# Altium schematic sheet cpu.SchDoc
size A3
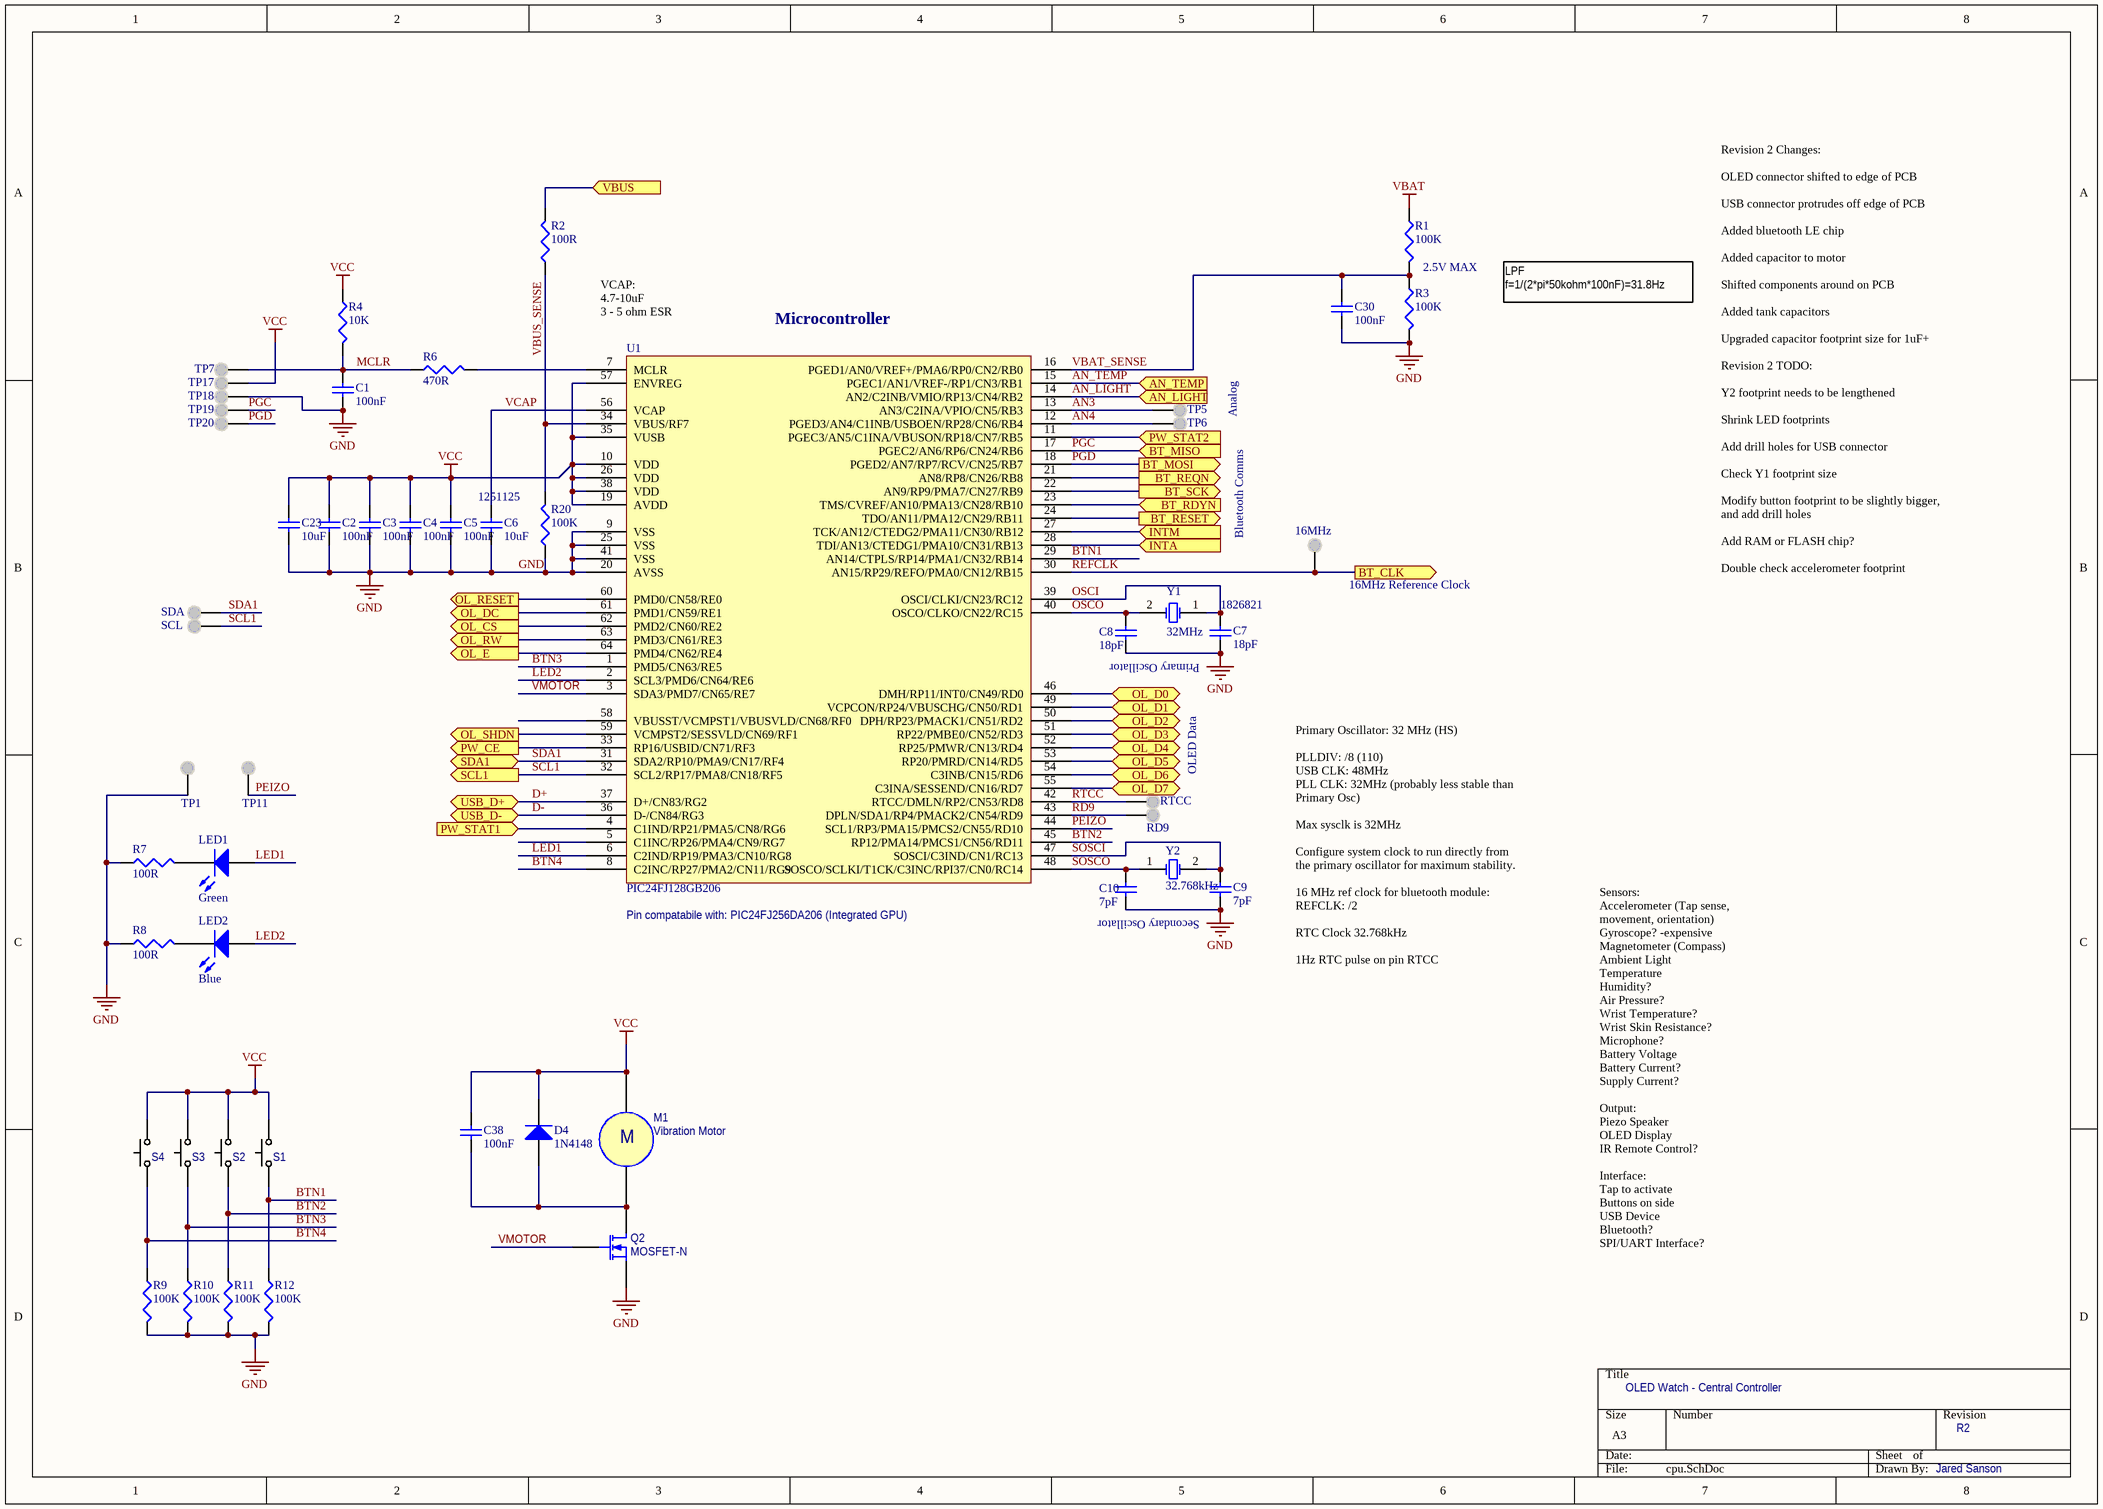
[diagram p0: cpu.SchDoc]

## Parts
C1  value 100nF  [0603C]  (hidden comment: Cap)
C2  value 100nF  [0603C]  (hidden comment: Cap)
C3  value 100nF  [0603C]  (hidden comment: Cap)
C4  value 100nF  [0603C]  (hidden comment: Cap)
C5  value 100nF  [0603C]  (hidden comment: Cap)
C6  value 10uF  Supplier Part Number 1: 1251125  [0805C]  (hidden comment: Cap)
C7  value 18pF  [0603C]  (hidden comment: Cap)
C8  value 18pF  [0603C]  (hidden comment: Cap)
C9  value 7pF  [0603C]  (hidden comment: Cap)
C10  value 7pF  [0603C]  (hidden comment: Cap)
C23  value 10uF  [0805C]  (hidden comment: Cap)
C30  value 100nF  [0603C]  (hidden comment: Cap)
C38  value 100nF  [0603C]  (hidden comment: Cap)
D4  1N4148  [0603D]
LED1  Green  [0603LED]
LED2  Blue  [0603LED]
M1  Vibration Motor  [VIBRATION_MOTOR]
OSC  16MHz  [TESTPOINT_TOP]
Q2  MOSFET-N  [SOT-23B_N]
R1  value 100K  [0603R]  (hidden comment: Res3)
R2  value 100R  [0603R]  (hidden comment: Res3)
R3  value 100K  [0603R]  (hidden comment: Res3)
R4  value 10K  [0603R]  (hidden comment: Res3)
R6  value 470R  [0603R]  (hidden comment: Res3)
R7  value 100R  [0603R]  (hidden comment: Res3)
R8  value 100R  [0603R]  (hidden comment: Res3)
R9  value 100K  [0603R]  (hidden comment: Res3)
R10  value 100K  [0603R]  (hidden comment: Res3)
R11  value 100K  [0603R]  (hidden comment: Res3)
R12  value 100K  [0603R]  (hidden comment: Res3)
R20  value 100K  [0603R]  (hidden comment: Res3)
RD9  (no value)  [TESTPOINT_TOP]
RTCC  RTCC  [TESTPOINT_TOP]  (value not drawn)
S1  SideButton  [SIDE_BUTTON]  (value not drawn)
S2  SideButton  [SIDE_BUTTON]  (value not drawn)
S3  SideButton  [SIDE_BUTTON]  (value not drawn)
S4  SideButton  [SIDE_BUTTON]  (value not drawn)
SCL  SCL  [TESTPOINT_TOP]  (value not drawn)
SDA  SDA  [TESTPOINT_TOP]  (value not drawn)
TP1  PZ-  [TESTPOINT_TOP]  (value not drawn)
TP5  AN4  [TESTPOINT_TOP]  (value not drawn)
TP6  AN5  [TESTPOINT_TOP]  (value not drawn)
TP7  MCLR  [TESTPOINT_TOP]  (value not drawn)
TP11  PZ+  [TESTPOINT_TOP]  (value not drawn)
TP17  VCC  [TESTPOINT_TOP]  (value not drawn)
TP18  GND  [TESTPOINT_TOP]  (value not drawn)
TP19  PGC  [TESTPOINT_TOP]  (value not drawn)
TP20  PGD  [TESTPOINT_TOP]  (value not drawn)
U1  PIC24FJ128GB206  [TQFP_64_10MM]
Y1  32MHz  Supplier Part Number 1: 1826821  [ABRACON32MHZ]
Y2  32.768kHz  [BCY-W2/D1.5]

## Ports
AN_LIGHT (in), AN_TEMP (in), BT_CLK (out), BT_MISO (in), BT_MOSI (out), BT_RDYN (in), BT_REQN (out), BT_RESET (out), BT_SCK (out), INTA (in), INTM (in), OL_CS (out), OL_D0 (bidir), OL_D1 (bidir), OL_D2 (bidir), OL_D3 (bidir), OL_D4 (bidir), OL_D5 (bidir), OL_D6 (bidir), OL_D7 (bidir), OL_DC (out), OL_E (out), OL_RESET (out), OL_RW (out), OL_SHDN (out), PW_CE (out), PW_STAT1 (in), PW_STAT2 (in), SCL1 (out), SDA1 (bidir), USB_D+ (bidir), USB_D- (bidir), VBUS (in)

## Nets
GND: C1.2 C2.2 C3.2 C4.2 C5.2 C6.2 C7.2 C8.2 C9.2 C10.2 C23.2 C30.2 Q2.3(S) R3.2 R7.1 R8.1 R9.2 R10.2 R11.2 R12.2 R20.1 TP1.1(TP) TP18.1(TP) U1.9(VSS) U1.20(AVSS) U1.25(VSS) U1.41(VSS)
VBAT: R1.1
VCC: C2.1 C3.1 C4.1 C5.1 C23.1 C38.1 D4.2(K) M1.1 R4.1 S1.2 S2.2 S3.2 S4.2 TP17.1(TP) U1.10(VDD) U1.19(AVDD) U1.26(VDD) U1.35(VUSB) U1.38(VDD) U1.57(ENVREG)
AN3: TP5.1(TP) U1.13(AN3/C2INA/VPIO/CN5/RB3)
AN4: TP6.1(TP) U1.12(PGED3/AN4/C1INB/USBOEN/RP28/CN6/RB4)
AN_LIGHT: U1.14(AN2/C2INB/VMIO/RP13/CN4/RB2) ; port AN_LIGHT
AN_TEMP: U1.15(PGEC1/AN1/VREF-/RP1/CN3/RB1) ; port AN_TEMP
BT_RDYN: U1.23(TMS/CVREF/AN10/PMA13/CN28/RB10) ; port BT_RDYN
BT_REQN: U1.21(AN8/RP8/CN26/RB8) ; port BT_REQN
BT_RESET: U1.24(TDO/AN11/PMA12/CN29/RB11) ; port BT_RESET
BT_SCK: U1.22(AN9/RP9/PMA7/CN27/RB9) ; port BT_SCK
BTN1: R12.1 S1.1 U1.29(AN14/CTPLS/RP14/PMA1/CN32/RB14)
BTN2: R11.1 S2.1 U1.45(RP12/PMA14/PMCS1/CN56/RD11)
BTN3: R10.1 S3.1 U1.1(PMD5/CN63/RE5)
BTN4: R9.1 S4.1 U1.8(C2INC/RP27/PMA2/CN11/RG9)
D+: U1.37(D+/CN83/RG2) ; port USB_D+
D-: U1.36(D-/CN84/RG3) ; port USB_D-
INTA: U1.28(TDI/AN13/CTEDG1/PMA10/CN31/RB13) ; port INTA
INTM: U1.27(TCK/AN12/CTEDG2/PMA11/CN30/RB12) ; port INTM
LED1: LED1.1(A) U1.6(C2IND/RP19/PMA3/CN10/RG8)
LED2: LED2.1(A) U1.2(SCL3/PMD6/CN64/RE6)
MCLR: C1.1 R4.2 R6.1 TP7.1(TP)
OL_CS: U1.62(PMD2/CN60/RE2) ; port OL_CS
OL_D0: U1.46(DMH/RP11/INT0/CN49/RD0) ; port OL_D0
OL_D1: U1.49(VCPCON/RP24/VBUSCHG/CN50/RD1) ; port OL_D1
OL_D2: U1.50(DPH/RP23/PMACK1/CN51/RD2) ; port OL_D2
OL_D3: U1.51(RP22/PMBE0/CN52/RD3) ; port OL_D3
OL_D4: U1.52(RP25/PMWR/CN13/RD4) ; port OL_D4
OL_D5: U1.53(RP20/PMRD/CN14/RD5) ; port OL_D5
OL_D6: U1.54(C3INB/CN15/RD6) ; port OL_D6
OL_D7: U1.55(C3INA/SESSEND/CN16/RD7) ; port OL_D7
OL_DC: U1.61(PMD1/CN59/RE1) ; port OL_DC
OL_E: U1.64(PMD4/CN62/RE4) ; port OL_E
OL_RESET: U1.60(PMD0/CN58/RE0) ; port OL_RESET
OL_RW: U1.63(PMD3/CN61/RE3) ; port OL_RW
OL_SHDN: U1.59(VCMPST2/SESSVLD/CN69/RF1) ; port OL_SHDN
OSCI: C7.1 U1.39(OSCI/CLKI/CN23/RC12) Y1.1(OSC1)
OSCO: C8.1 U1.40(OSCO/CLKO/CN22/RC15) Y1.2(OSC2)
PEIZO: TP11.1(TP) U1.44(SCL1/RP3/PMA15/PMCS2/CN55/RD10)
PGC: TP19.1(TP) U1.17(PGEC2/AN6/RP6/CN24/RB6) ; port BT_MISO
PGD: TP20.1(TP) U1.18(PGED2/AN7/RP7/RCV/CN25/RB7) ; port BT_MOSI
PW_CE: U1.33(RP16/USBID/CN71/RF3) ; port PW_CE
PW_STAT1: U1.4(C1IND/RP21/PMA5/CN8/RG6) ; port PW_STAT1
PW_STAT2: U1.11(PGEC3/AN5/C1INA/VBUSON/RP18/CN7/RB5) ; port PW_STAT2
RD9: RD9.1(TP) U1.43(DPLN/SDA1/RP4/PMACK2/CN54/RD9)
REFCLK: OSC.1(TP) U1.30(AN15/RP29/REFO/PMA0/CN12/RB15) ; port BT_CLK
RTCC: RTCC.1(TP) U1.42(RTCC/DMLN/RP2/CN53/RD8)
SCL1: SCL.1(TP) U1.32(SCL2/RP17/PMA8/CN18/RF5) ; port SCL1
SDA1: SDA.1(TP) U1.31(SDA2/RP10/PMA9/CN17/RF4) ; port SDA1
SOSCI: C9.1 U1.47(SOSCI/C3IND/CN1/RC13) Y2.2(OSC2)
SOSCO: C10.1 U1.48(SOSCO/SCLKI/T1CK/C3INC/RPI37/CN0/RC14) Y2.1(OSC1)
VBAT_SENSE: C30.1 R1.2 R3.1 U1.16(PGED1/AN0/VREF+/PMA6/RP0/CN2/RB0)
VBUS: R2.2 ; port VBUS
VBUS_SENSE: R2.1 R20.2 U1.34(VBUS/RF7)
VCAP: C6.1 U1.56(VCAP)
VMOTOR: Q2.2(G) U1.3(SDA3/PMD7/CN65/RE7)
NetC38_2: C38.2 D4.1(A) M1.2 Q2.1(D)
NetLED1_2: LED1.2(K) R7.2
NetLED2_2: LED2.2(K) R8.2
NetR6_2: R6.2 U1.7(MCLR)

Not connected (* = marked no-connect by the designer): U1 5(C1INC/RP26/PMA4/CN9/RG7) 58(VBUSST/VCMPST1/VBUSVLD/CN68/RF0)

## Notes on the sheet
- 2.5V MAX
- LPF
  f=1/(2*pi*50kohm*100nF)=31.8Hz
- VCAP:
  4.7-10uF
  3 - 5 ohm ESR
- (near U1) Microcontroller
- Analog
- Bluetooth Comms
- (near OSC) 16MHz Reference Clock
- Primary Oscillator
- OLED Data
- Revision 2 Changes:
  OLED connector shifted to edge of PCB
  USB connector protrudes off edge of PCB
  Added bluetooth LE chip
  Added capacitor to motor
  Shifted components around on PCB
  Added tank capacitors
  Upgraded capacitor footprint size for 1uF+
  Revision 2 TODO:
  Y2 footprint needs to be lengthened
  Shrink LED footprints
  Add drill holes for USB connector
  Check Y1 footprint size
  Modify button footprint to be slightly bigger, and add drill holes
  Add RAM or FLASH chip?
  Double check accelerometer footprint
- (near U1) Pin compatabile with: PIC24FJ256DA206 (Integrated GPU)
- Secondary Oscillator
- Primary Oscillator: 32 MHz (HS)
  PLLDIV: /8 (110)
  USB CLK: 48MHz
  PLL CLK: 32MHz (probably less stable than Primary Osc)
  Max sysclk is 32MHz
  Configure system clock to run directly from the primary oscillator for maximum stability.
  16 MHz ref clock for bluetooth module:
  REFCLK: /2
  RTC Clock 32.768kHz
  1Hz RTC pulse on pin RTCC
- Sensors:
  Accelerometer (Tap sense, movement, orientation)
  Gyroscope? -expensive
  Magnetometer (Compass)
  Ambient Light
  Temperature
  Humidity?
  Air Pressure?
  Wrist Temperature?
  Wrist Skin Resistance?
  Microphone?
  Battery Voltage
  Battery Current?
  Supply Current?
  Output:
  Piezo Speaker
  OLED Display
  IR Remote Control?
  Interface:
  Tap to activate
  Buttons on side
  USB Device
  Bluetooth?
  SPI/UART Interface?
- OLED Watch - Central Controller
- R2
- Jared Sanson
- (in symbol VibrationMotor) M

## Library data of the parts
C1-C10 C23 C30 C38 = Cap: Capacitor; Published: 8-Jun-2000; LatestRevisionDate: 17-Jul-2002; LatestRevisionNote: Re-released for DXP Platform.; PackageReference: RAD-0.3; Publisher: Altium Limited; PackageDescription: Radial Cap, Thru-Hole; 2 Leads; 0.3 in Pin Spacing
  C6: Supplier 1: Farnell
D4 = Diode: Default Diode; Published: 8-Jun-2000; LatestRevisionDate: 17-Jul-2002; LatestRevisionNote: Re-released for DXP Platform.; PackageVersion: Sep-1996; PackageReference: SMC; Publisher: Altium Limited; PackageDescription: DO-214-AB/SMC; 2 C-Bend Leads; Body 7.9 x 5.9 mm, inc. leads (LxW); Code_JEDEC: DO-214-AB
LED1 LED2 = LED2: Typical RED, GREEN, YELLOW, AMBER GaAs LED; Published: 8-Jun-2000; LatestRevisionDate: 17-Jul-2002; LatestRevisionNote: Re-released for DXP Platform.; PackageVersion: Feb-2002; PackageReference: 3.2X1.6X1.1; Publisher: Altium Limited; PackageDescription: SM LED; 2 Flat Leads
M1 = VibrationMotor
OSC RD9 RTCC SCL SDA TP1 TP5-TP7 TP11 TP17-TP20 = TestPoint: Test Point; Comment_1: *
Q2 = MOSFET-N: N-Channel MOSFET; Published: 8-Jun-2000; LatestRevisionDate: 17-Jul-2002; LatestRevisionNote: Re-released for DXP Platform.; PackageVersion: 1995/1996; PackageReference: E3; Publisher: Altium Limited; PackageDescription: TO, Flat Index; 3 In-Line, Axial Leads; Body Dia. 4.6mm; Lead Dia. 0.5 mm (max)
R1-R4 R6-R12 R20 = Res3: Resistor; Published: 8-Jun-2000; LatestRevisionDate: 29-May-2009; LatestRevisionNote: IPC-7351 Footprint Added.; PackageReference: J1-0603; Publisher: Altium Limited; PackageDescription: Chip Resistor
Y1 = XTAL: Crystal Oscillator; Manufacturer: ABRACON; Manufacturer Part Number: ABM3-32.000MHZ-D2Y-T; Description: ABRACON - ABM3-32.000MHZ-D2Y-T - CRYSTAL, 32MHZ, 18PF, SMD; Published: 8-Jun-2000; LatestRevisionDate: 17-Jul-2002; LatestRevisionNote: Re-released for DXP Platform.; PackageReference: R38; Publisher: Altium Limited; PackageDescription: Crystal, Thru-Hole; 2 Leads; Body 3.1 x 8.2 mm (Dia.xH); Supplier 1: Farnell; RoHS: Y-EX; Stock 1: 728; Pricing 1: 1=2.88, 10=2.25, 50=1.75, 100=1.26, 500=1.02 (NZD); ComponentLink1URL: http://www.abracon.com/Resonators/abm3.pdf; ComponentLink1Description: http://www.abracon.com/Resonators/abm3.pdf
Y2 = XTAL: Crystal Oscillator; Published: 8-Jun-2000; LatestRevisionDate: 17-Jul-2002; LatestRevisionNote: Re-released for DXP Platform.; PackageReference: R38; Publisher: Altium Limited; PackageDescription: Crystal, Thru-Hole; 2 Leads; Body 3.1 x 8.2 mm (Dia.xH)